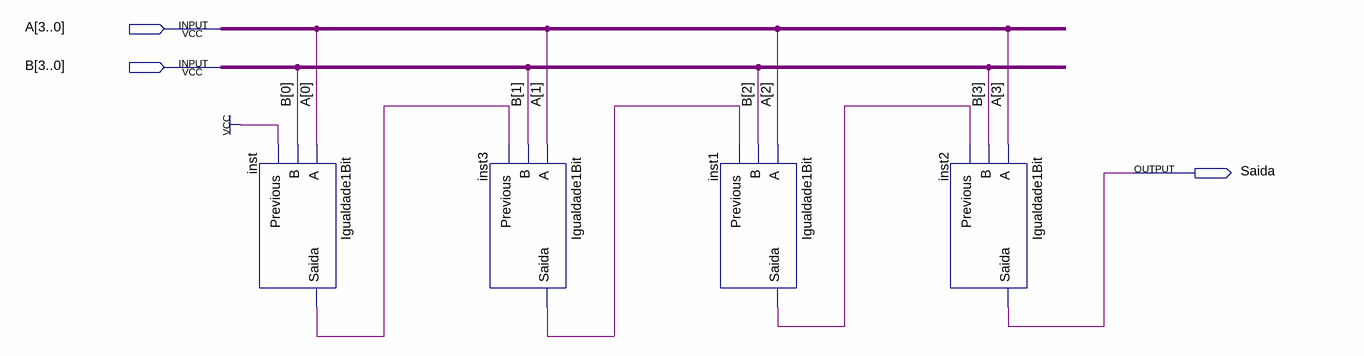
[diagram p0: schematic sheet]
// Quartus schematic Igualdade4Bits.bdf as structural Verilog: 4 symbols, 3 pins
module Igualdade4Bits (
  input  [3:0] A,
  input  [3:0] B,
  output Saida
);

  wire inst1_saida, inst3_saida, inst_saida;

  Igualdade1Bit inst (.A(A[0]), .B(B[0]), .Previous(1'b1), .Saida(inst_saida));
  Igualdade1Bit inst3 (.A(A[1]), .B(B[1]), .Previous(inst_saida), .Saida(inst3_saida));
  Igualdade1Bit inst1 (.A(A[2]), .B(B[2]), .Previous(inst3_saida), .Saida(inst1_saida));
  Igualdade1Bit inst2 (.A(A[3]), .B(B[3]), .Previous(inst1_saida), .Saida(Saida));
endmodule
